# Altium schematic sheet obc_rtc.SchDoc: Real Time Clock
size A4; DrawnBy: Mohamed Hirole; Organization: UTAT SS; DocumentNumber: 3; Revision: 2.0; SheetNumber: 3; SheetTotal: 8
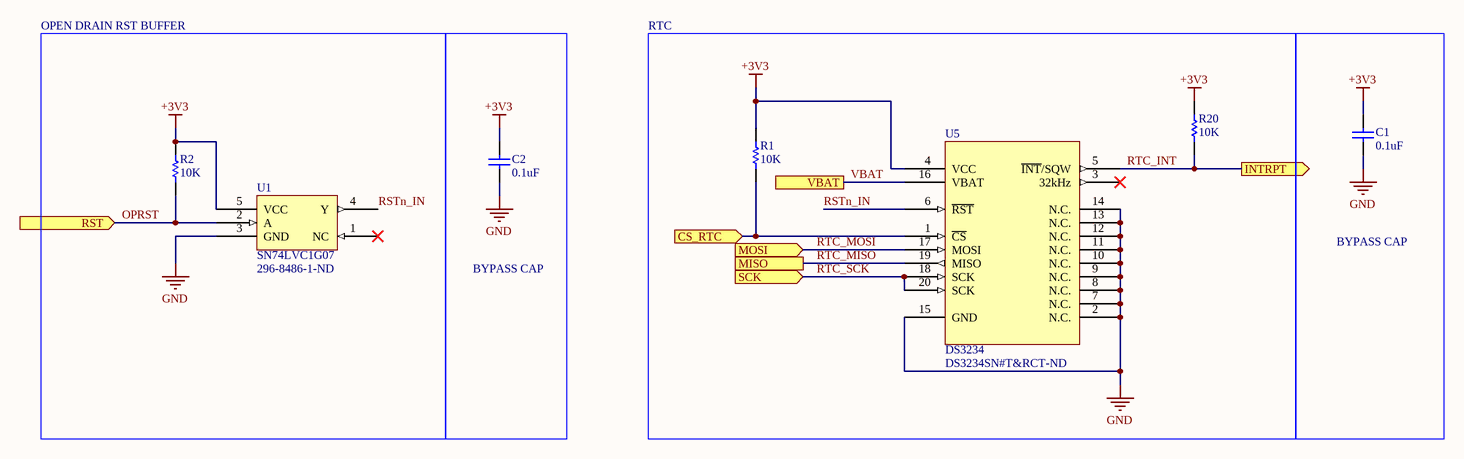
[diagram p0: obc_rtc.SchDoc]

## Parts
C1  value 0.1uF  [CAP0603R]  (hidden comment: 0603)
C2  value 0.1uF  [CAP0603R]  (hidden comment: 0603)
R1  value 10K  [RES0603R]  (hidden comment: 0603)
R2  value 10K  [RES0603R]  (hidden comment: 0603)
R20  value 10K  [RES0603R]  (hidden comment: 0603)
U1  SN74LVC1G07  Supplier Part Number 1: 296-8486-1-ND  [SOT65P210X110-5N]
U5  DS3234  Supplier Part Number 2: DS3234SN#T&RCT-ND  [SOIC127P1032X265-20]

## Blocks framed on the sheet
OPEN DRAIN RST BUFFER: R2 U1
BYPASS CAP: C2
RTC: R1 R20 U5
BYPASS CAP: C1

## Ports
CS_RTC (in), INTRPT (out), MISO, MOSI (in), RST (in), SCK (in), VBAT

## Nets
+3V3: C1.2 C2.2 R1.2 R2.2 R20.2 U1.5(VCC) U5.4(VCC)
GND: C1.1 C2.1 U1.3(GND) U5.2(N.C.) U5.7(N.C.) U5.8(N.C.) U5.9(N.C.) U5.10(N.C.) U5.11(N.C.) U5.12(N.C.) U5.13(N.C.) U5.14(N.C.) U5.15(GND)
CS_RTC: R1.1 U5.1(~{CS}) ; port CS_RTC
OPRST: R2.1 U1.2(A) ; port RST
RSTn_IN: U1.4(Y) U5.6(~{RST})
RTC_INT: R20.1 U5.5(~{INT}/SQW) ; port INTRPT
RTC_MISO: U5.19(MISO) ; port MISO
RTC_MOSI: U5.17(MOSI) ; port MOSI
RTC_SCK: U5.18(SCK) U5.20(SCK) ; port SCK
VBAT: U5.16(VBAT) ; port VBAT

Not connected (* = marked no-connect by the designer): U1 1(NC)*; U5 3(32kHz)*

## Library data of the parts
C1 C2 = CAP0603: 0603 capacitor
R1 R2 R20 = RES0603: 0603 resistor
U1 = SN74LVC1G07: Single element non-inverting open drain buffer; Supplier 1: Digi-Key
U5 = DS3234: SPI bus RTC with integrated crystal and SRAM; Supplier 1: Digi-Key; Supplier 2: Digi-Key